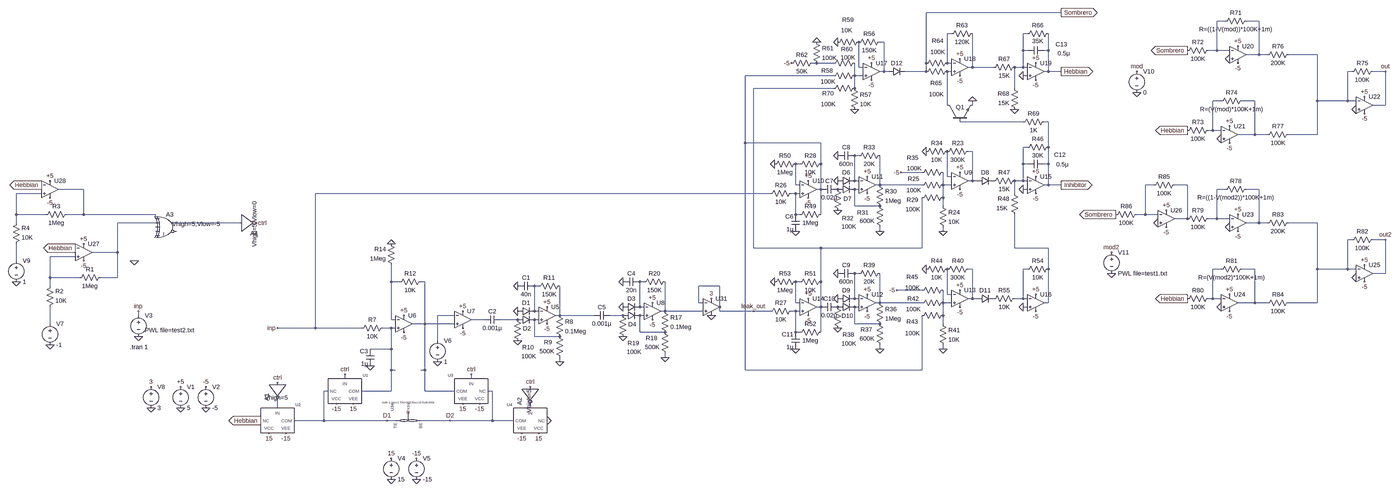
[diagram p0: schematic Draft2.asc, whole sheet]
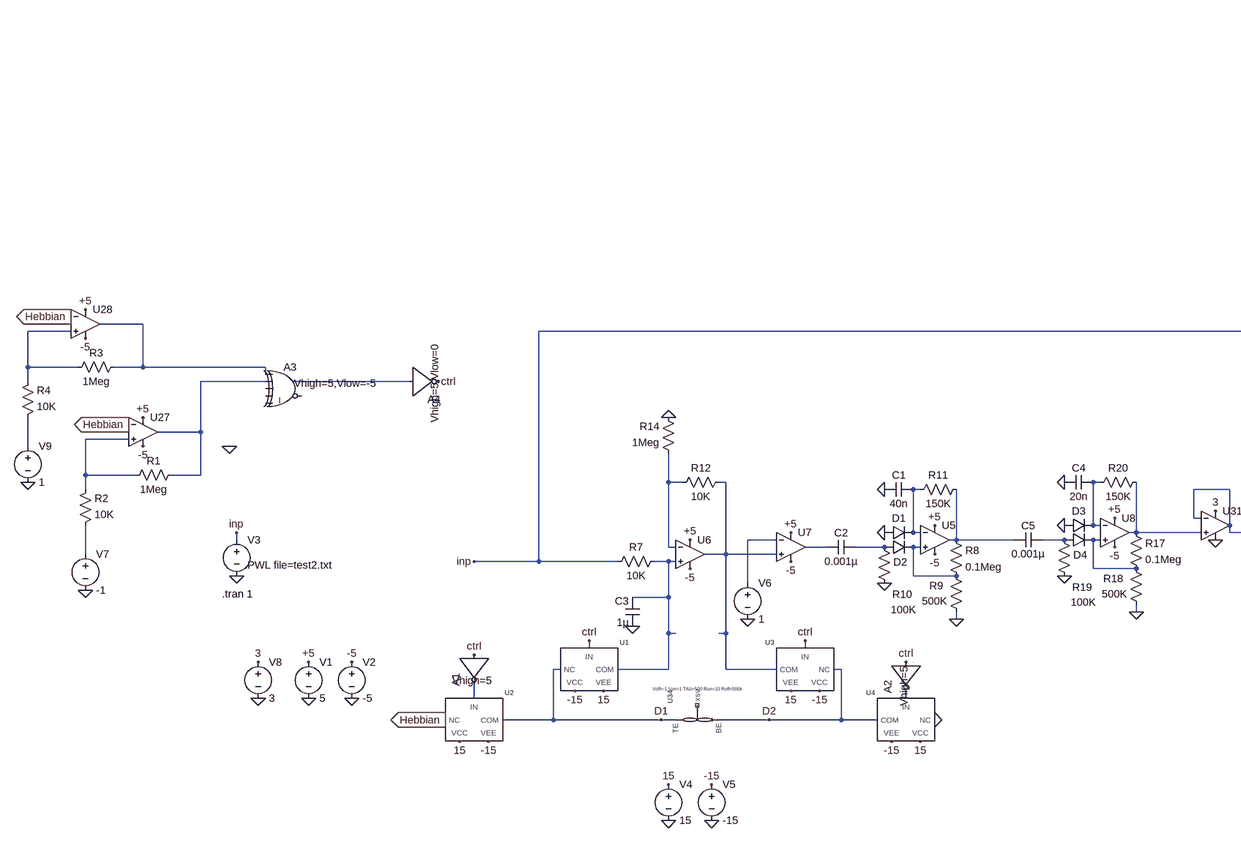
[diagram p1: schematic Draft2.asc, part, row 1 of 1, column 1 of 2]
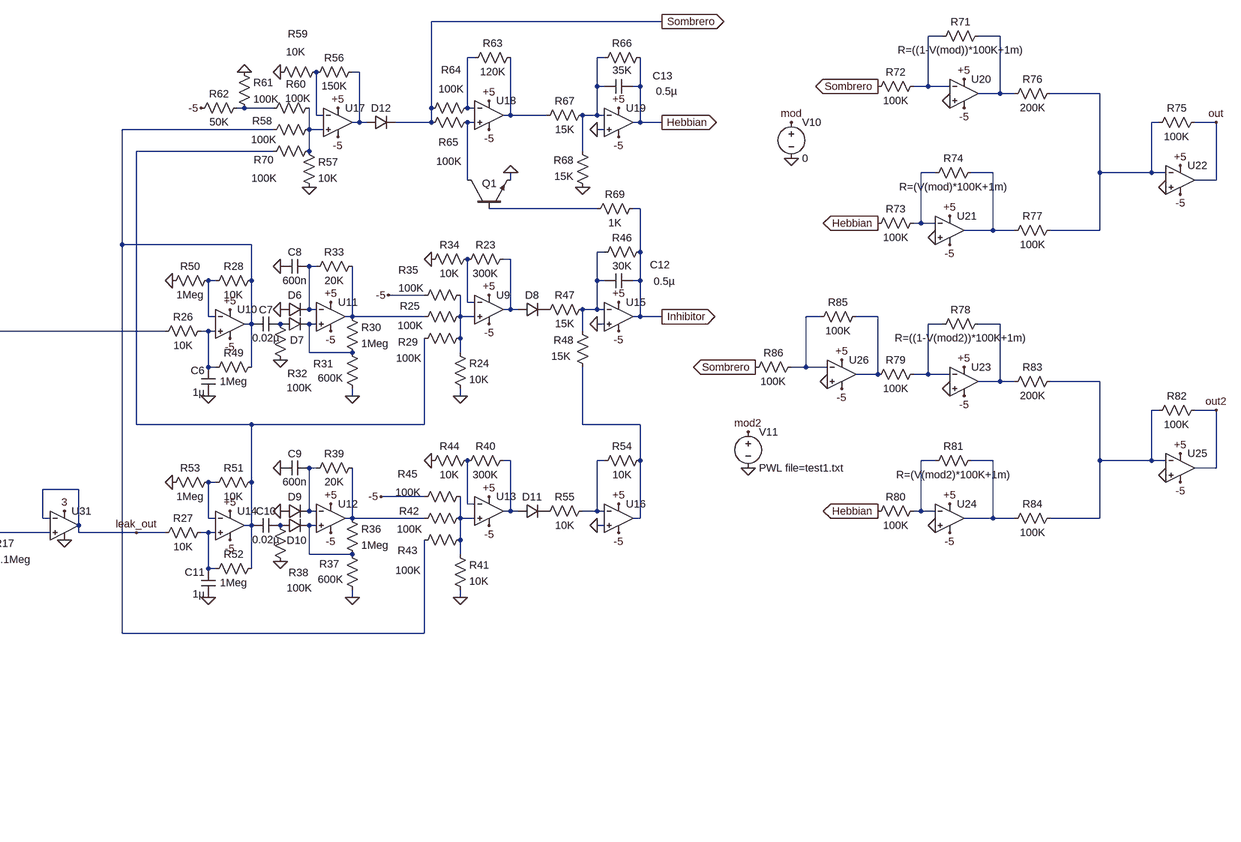
[diagram p2: schematic Draft2.asc, part, row 1 of 1, column 2 of 2]
Draft2.asc, the LTspice schematic file:
Version 4
SHEET 1 6588 1044
WIRE 4112 -1312 3600 -1312
WIRE 4736 -1280 4704 -1280
WIRE 4864 -1280 4816 -1280
WIRE 3696 -1232 3680 -1232
WIRE 3984 -1232 3968 -1232
WIRE 3440 -1200 3424 -1200
WIRE 3968 -1168 3968 -1232
WIRE 3984 -1168 3968 -1168
WIRE 4064 -1168 4064 -1232
WIRE 4064 -1168 4048 -1168
WIRE 4704 -1168 4704 -1280
WIRE 4704 -1168 4672 -1168
WIRE 4752 -1168 4704 -1168
WIRE 4864 -1152 4864 -1280
WIRE 4864 -1152 4816 -1152
WIRE 4896 -1152 4864 -1152
WIRE 5136 -1152 4976 -1152
WIRE 3184 -1120 3168 -1120
WIRE 3248 -1120 3184 -1120
WIRE 3600 -1120 3600 -1312
WIRE 3680 -1120 3680 -1232
WIRE 3696 -1120 3680 -1120
WIRE 3344 -1104 3344 -1200
WIRE 3360 -1104 3344 -1104
WIRE 3776 -1104 3776 -1232
WIRE 3776 -1104 3760 -1104
WIRE 3856 -1104 3776 -1104
WIRE 3968 -1104 3968 -1168
WIRE 3968 -1104 3936 -1104
WIRE 3984 -1104 3968 -1104
WIRE 3440 -1088 3440 -1200
WIRE 3440 -1088 3424 -1088
WIRE 3456 -1088 3440 -1088
WIRE 3600 -1088 3600 -1120
WIRE 3600 -1088 3520 -1088
WIRE 3696 -1088 3680 -1088
WIRE 4064 -1088 4064 -1168
WIRE 4064 -1088 4048 -1088
WIRE 4112 -1088 4064 -1088
WIRE 5280 -1088 5264 -1088
WIRE 5408 -1088 5360 -1088
WIRE 3248 -1072 2912 -1072
WIRE 3328 -1072 3328 -1120
WIRE 3360 -1072 3328 -1072
WIRE 3984 -1072 3968 -1072
WIRE 3248 -1024 2944 -1024
WIRE 3328 -1024 3328 -1072
WIRE 3936 -1024 3936 -1104
WIRE 4720 -976 4688 -976
WIRE 4848 -976 4800 -976
WIRE 5136 -976 5136 -1152
WIRE 5264 -976 5264 -1088
WIRE 5264 -976 5136 -976
WIRE 5296 -976 5264 -976
WIRE 3680 -960 3680 -1088
WIRE 3776 -960 3776 -976
WIRE 5408 -960 5408 -1088
WIRE 5408 -960 5360 -960
WIRE 3968 -896 3728 -896
WIRE 4064 -896 4048 -896
WIRE 4688 -864 4688 -976
WIRE 4688 -864 4672 -864
WIRE 4720 -864 4688 -864
WIRE 4848 -848 4848 -976
WIRE 4848 -848 4784 -848
WIRE 4896 -848 4848 -848
WIRE 5136 -848 5136 -976
WIRE 5136 -848 4976 -848
WIRE 2912 -816 2912 -1072
WIRE 3200 -816 2912 -816
WIRE 3984 -800 3968 -800
WIRE 4064 -800 4064 -896
WIRE 3776 -784 3760 -784
WIRE 3344 -768 3328 -768
WIRE 3120 -736 3104 -736
WIRE 3200 -736 3200 -816
WIRE 3968 -736 3968 -800
WIRE 3984 -736 3968 -736
WIRE 4064 -736 4064 -800
WIRE 4064 -736 4048 -736
WIRE 3584 -704 3504 -704
WIRE 3680 -688 3680 -784
WIRE 3696 -688 3680 -688
WIRE 3328 -672 3328 -768
WIRE 3344 -672 3328 -672
WIRE 3776 -672 3776 -784
WIRE 3776 -672 3760 -672
WIRE 3792 -672 3776 -672
WIRE 3968 -672 3968 -736
WIRE 3968 -672 3936 -672
WIRE 3984 -672 3968 -672
WIRE 3104 -656 3104 -736
WIRE 3120 -656 3104 -656
WIRE 3424 -656 3424 -768
WIRE 3424 -656 3408 -656
WIRE 3584 -656 3424 -656
WIRE 3664 -656 3664 -704
WIRE 3696 -656 3664 -656
WIRE 4064 -656 4064 -736
WIRE 4064 -656 4048 -656
WIRE 4112 -656 4064 -656
WIRE 4464 -656 4432 -656
WIRE 4592 -656 4544 -656
WIRE 400 -640 304 -640
WIRE 3200 -640 3200 -736
WIRE 3200 -640 3184 -640
WIRE 3344 -640 3328 -640
WIRE 3984 -640 3968 -640
WIRE 4736 -640 4704 -640
WIRE 4864 -640 4816 -640
WIRE 240 -624 144 -624
WIRE 3008 -624 1280 -624
WIRE 3104 -624 3088 -624
WIRE 3120 -624 3104 -624
WIRE 3936 -624 3936 -672
WIRE 3664 -608 3664 -656
WIRE 3328 -576 3328 -640
WIRE 3424 -576 3328 -576
WIRE 3664 -576 3664 -608
WIRE 144 -544 144 -624
WIRE 256 -544 144 -544
WIRE 400 -544 400 -640
WIRE 400 -544 336 -544
WIRE 672 -544 400 -544
WIRE 3104 -544 3104 -624
WIRE 3120 -544 3104 -544
WIRE 3200 -544 3200 -640
WIRE 4432 -544 4432 -656
WIRE 4432 -544 4400 -544
WIRE 4480 -544 4432 -544
WIRE 672 -528 672 -544
WIRE 4592 -528 4592 -656
WIRE 4592 -528 4544 -528
WIRE 4704 -528 4704 -640
WIRE 4704 -528 4672 -528
WIRE 4752 -528 4704 -528
WIRE 144 -512 144 -544
WIRE 672 -512 528 -512
WIRE 992 -512 736 -512
WIRE 4864 -512 4864 -640
WIRE 4864 -512 4816 -512
WIRE 4896 -512 4864 -512
WIRE 5136 -512 4976 -512
WIRE 3424 -480 3424 -496
WIRE 3664 -480 3664 -496
WIRE 5280 -448 5264 -448
WIRE 5408 -448 5360 -448
WIRE 2944 -416 2944 -1024
WIRE 3200 -416 2944 -416
WIRE 3584 -416 3584 -608
WIRE 3584 -416 3200 -416
WIRE 3936 -416 3936 -544
WIRE 4064 -416 3936 -416
WIRE 528 -400 528 -512
WIRE 528 -400 432 -400
WIRE 368 -384 272 -384
WIRE 144 -368 144 -432
WIRE 3776 -336 3760 -336
WIRE 3984 -336 3968 -336
WIRE 4064 -336 4064 -416
WIRE 4720 -336 4688 -336
WIRE 4848 -336 4800 -336
WIRE 5136 -336 5136 -512
WIRE 5264 -336 5264 -448
WIRE 5264 -336 5136 -336
WIRE 5296 -336 5264 -336
WIRE 3344 -320 3328 -320
WIRE 5408 -320 5408 -448
WIRE 5408 -320 5360 -320
WIRE 272 -304 272 -384
WIRE 384 -304 272 -304
WIRE 528 -304 528 -400
WIRE 528 -304 464 -304
WIRE 1568 -288 1568 -352
WIRE 1600 -288 1568 -288
WIRE 1696 -288 1680 -288
WIRE 2528 -288 2512 -288
WIRE 3120 -288 3104 -288
WIRE 3200 -288 3200 -416
WIRE 272 -272 272 -304
WIRE 2128 -272 2112 -272
WIRE 2816 -272 2736 -272
WIRE 3584 -256 3488 -256
WIRE 3680 -240 3680 -336
WIRE 3696 -240 3680 -240
WIRE 3328 -224 3328 -320
WIRE 3344 -224 3328 -224
WIRE 3776 -224 3776 -336
WIRE 3776 -224 3760 -224
WIRE 3792 -224 3776 -224
WIRE 3968 -224 3968 -336
WIRE 3968 -224 3936 -224
WIRE 3984 -224 3968 -224
WIRE 4688 -224 4688 -336
WIRE 4688 -224 4672 -224
WIRE 4720 -224 4688 -224
WIRE 2736 -208 2736 -272
WIRE 2752 -208 2736 -208
WIRE 3104 -208 3104 -288
WIRE 3120 -208 3104 -208
WIRE 3424 -208 3424 -320
WIRE 3424 -208 3408 -208
WIRE 3584 -208 3424 -208
WIRE 3664 -208 3664 -256
WIRE 3696 -208 3664 -208
WIRE 4064 -208 4064 -336
WIRE 4064 -208 4048 -208
WIRE 4848 -208 4848 -336
WIRE 4848 -208 4784 -208
WIRE 4896 -208 4848 -208
WIRE 5136 -208 5136 -336
WIRE 5136 -208 4976 -208
WIRE 2512 -192 2512 -288
WIRE 2528 -192 2512 -192
WIRE 2816 -192 2816 -272
WIRE 3200 -192 3200 -288
WIRE 3200 -192 3184 -192
WIRE 3344 -192 3328 -192
WIRE 3984 -192 3968 -192
WIRE 2112 -176 2112 -272
WIRE 2128 -176 2112 -176
WIRE 2608 -176 2608 -288
WIRE 2608 -176 2592 -176
WIRE 2752 -176 2608 -176
WIRE 2816 -176 2816 -192
WIRE 2944 -176 2816 -176
WIRE 3008 -176 2944 -176
WIRE 3104 -176 3088 -176
WIRE 3120 -176 3104 -176
WIRE 608 -160 608 -176
WIRE 1808 -160 1744 -160
WIRE 2208 -160 2208 -272
WIRE 2208 -160 2192 -160
WIRE 2336 -160 2208 -160
WIRE 2448 -160 2400 -160
WIRE 2528 -160 2512 -160
WIRE 3664 -160 3664 -208
WIRE 1568 -144 1568 -288
WIRE 1584 -144 1568 -144
WIRE 1920 -144 1872 -144
WIRE 2048 -144 1984 -144
WIRE 2128 -144 2112 -144
WIRE 272 -128 272 -192
WIRE 1696 -128 1696 -288
WIRE 1696 -128 1648 -128
WIRE 1808 -128 1696 -128
WIRE 3328 -128 3328 -192
WIRE 3424 -128 3328 -128
WIRE 3664 -128 3664 -160
WIRE 1280 -112 1280 -624
WIRE 1280 -112 1136 -112
WIRE 1456 -112 1280 -112
WIRE 1568 -112 1536 -112
WIRE 1584 -112 1568 -112
WIRE 2512 -96 2512 -160
WIRE 2608 -96 2512 -96
WIRE 3104 -96 3104 -176
WIRE 3120 -96 3104 -96
WIRE 3200 -96 3200 -192
WIRE 2112 -80 2112 -144
WIRE 2208 -80 2112 -80
WIRE 1744 -64 1744 -160
WIRE 1568 -32 1568 -112
WIRE 1568 -32 1488 -32
WIRE 3424 -32 3424 -48
WIRE 3664 -32 3664 -48
WIRE 2608 0 2608 -16
WIRE 2208 16 2208 0
WIRE 1568 48 1568 -32
WIRE 1584 48 1568 48
WIRE 1696 48 1696 -128
WIRE 1696 48 1680 48
WIRE 2912 48 2912 -816
WIRE 3584 48 3584 -160
WIRE 3584 48 2912 48
WIRE 1392 80 1392 64
WIRE 1872 80 1872 64
WIRE 1328 128 1312 128
WIRE 1568 128 1568 48
WIRE 1568 128 1456 128
WIRE 1696 128 1696 48
WIRE 1808 128 1696 128
WIRE 1952 128 1936 128
WIRE 1136 192 1136 160
WIRE 2096 192 2096 176
WIRE 1312 240 1312 128
WIRE 1312 240 1200 240
WIRE 1552 240 1312 240
WIRE 1584 240 1552 240
WIRE 1792 240 1680 240
WIRE 1952 240 1952 128
WIRE 1952 240 1792 240
WIRE 2032 240 1952 240
FLAG 768 112 +5
FLAG 864 112 -5
FLAG 768 192 0
FLAG 864 192 0
FLAG 608 -80 0
FLAG 608 -176 inp
FLAG 2160 -192 +5
FLAG 2160 -128 -5
FLAG 2048 -176 0
FLAG 2048 -272 0
FLAG 2048 -64 0
FLAG 2208 16 0
FLAG 1616 -160 +5
FLAG 1616 -96 -5
FLAG 1488 32 0
FLAG 1568 -432 0
FLAG 1840 -176 +5
FLAG 1840 -112 -5
FLAG 2560 -208 +5
FLAG 2560 -144 -5
FLAG 2448 -192 0
FLAG 2448 -288 0
FLAG 2448 -80 0
FLAG 2608 0 0
FLAG 3728 -704 +5
FLAG 3728 -640 -5
FLAG 3152 -672 +5
FLAG 3152 -608 -5
FLAG 3376 -688 +5
FLAG 3376 -624 -5
FLAG 3264 -672 0
FLAG 3264 -768 0
FLAG 3264 -560 0
FLAG 3600 -784 0
FLAG 3504 -704 -5
FLAG 3376 -240 +5
FLAG 3376 -176 -5
FLAG 3264 -224 0
FLAG 3264 -320 0
FLAG 3264 -112 0
FLAG 3424 -32 0
FLAG 3424 -480 0
FLAG 3728 -256 +5
FLAG 3728 -192 -5
FLAG 3600 -336 0
FLAG 3488 -256 -5
FLAG 3104 -480 0
FLAG 3024 -736 0
FLAG 3152 -224 +5
FLAG 3152 -160 -5
FLAG 3104 -32 0
FLAG 3024 -288 0
FLAG 4016 -688 +5
FLAG 4016 -624 -5
FLAG 4016 -240 +5
FLAG 4016 -176 -5
FLAG 3968 -192 0
FLAG 3968 -640 0
FLAG 3664 -480 0
FLAG 3664 -32 0
FLAG 4112 -656 Inhibitor
IOPIN 4112 -656 Out
FLAG 3392 -1120 +5
FLAG 3392 -1056 -5
FLAG 3264 -1200 0
FLAG 3184 -1200 0
FLAG 3728 -1136 +5
FLAG 3728 -1072 -5
FLAG 3088 -1120 -5
FLAG 4016 -1120 +5
FLAG 4016 -1056 -5
FLAG 3968 -1072 0
FLAG 3936 -944 0
FLAG 3776 -976 0
FLAG 4112 -1088 Hebbian
IOPIN 4112 -1088 Out
FLAG 4112 -1312 Sombrero
IOPIN 4112 -1312 Out
FLAG 3328 -944 0
FLAG 4752 -880 +5
FLAG 4752 -816 -5
FLAG 4784 -1184 +5
FLAG 4784 -1120 -5
FLAG 4752 -1136 0
FLAG 4720 -832 0
FLAG 5328 -992 +5
FLAG 5328 -928 -5
FLAG 5296 -944 0
FLAG 4592 -1168 Sombrero
IOPIN 4592 -1168 Out
FLAG 4592 -864 Hebbian
IOPIN 4592 -864 Out
FLAG 4400 -1008 0
FLAG 4400 -1088 mod
FLAG 5408 -1088 out
FLAG 4752 -240 +5
FLAG 4752 -176 -5
FLAG 4784 -544 +5
FLAG 4784 -480 -5
FLAG 4752 -496 0
FLAG 4720 -192 0
FLAG 5328 -352 +5
FLAG 5328 -288 -5
FLAG 5296 -304 0
FLAG 4320 -544 Sombrero
IOPIN 4320 -544 Out
FLAG 4592 -224 Hebbian
IOPIN 4592 -224 Out
FLAG 4304 -320 0
FLAG 4304 -400 mod2
FLAG 5408 -448 out2
FLAG 4512 -560 +5
FLAG 4512 -496 -5
FLAG 4480 -512 0
FLAG 1136 -112 inp
FLAG 1744 16 0
FLAG 2944 -176 leak_out
FLAG 2784 -160 0
FLAG 1360 176 -15
FLAG 1424 176 15
FLAG 1552 240 D1
FLAG 1104 288 15
FLAG 1168 288 -15
FLAG 2064 288 -15
FLAG 2128 288 15
FLAG 1840 176 15
FLAG 1904 176 -15
FLAG 1568 464 0
FLAG 1664 464 0
FLAG 1568 384 15
FLAG 1664 384 -15
FLAG 1792 240 D2
FLAG 1392 64 ctrl
FLAG 1872 64 ctrl
FLAG 2096 112 ctrl
FLAG 1136 96 ctrl
FLAG 400 -432 +5
FLAG 400 -368 -5
FLAG 272 -48 0
FLAG 368 -416 Hebbian
IOPIN 368 -416 Out
FLAG 272 -672 +5
FLAG 272 -608 -5
FLAG 144 -288 0
FLAG 240 -656 Hebbian
IOPIN 240 -656 Out
FLAG 1056 -512 ctrl
FLAG 656 112 3
FLAG 656 192 0
FLAG 2784 -224 3
FLAG 2160 240 0
FLAG 592 -368 0
FLAG 1072 240 Hebbian
IOPIN 1072 240 Out
SYMBOL voltage 768 96 R0
WINDOW 123 0 0 Left 2
WINDOW 39 0 0 Left 2
SYMATTR InstName V1
SYMATTR Value 5
SYMBOL voltage 864 96 R0
WINDOW 123 0 0 Left 2
WINDOW 39 0 0 Left 2
SYMATTR InstName V2
SYMATTR Value -5
SYMBOL voltage 608 -176 R0
WINDOW 123 0 0 Left 2
WINDOW 39 24 44 Left 2
WINDOW 3 24 72 Left 2
SYMATTR Value PWL file=test2.txt
SYMATTR InstName V3
SYMBOL res 1552 -128 R90
WINDOW 0 0 56 VBottom 2
WINDOW 3 32 56 VTop 2
SYMATTR InstName R7
SYMATTR Value 10K
SYMBOL Opamps\\UniversalOpamp2 2160 -160 R0
SYMATTR InstName U5
SYMBOL diode 2048 -160 R270
WINDOW 0 32 32 VTop 2
WINDOW 3 0 32 Invisible 2
SYMATTR InstName D1
SYMBOL diode 2048 -128 R270
WINDOW 0 -33 36 VTop 2
WINDOW 3 0 32 Invisible 2
SYMATTR InstName D2
SYMBOL res 2192 -176 R0
SYMATTR InstName R8
SYMATTR Value 0.1Meg
SYMBOL res 2224 16 R180
WINDOW 0 45 74 Left 2
WINDOW 3 36 40 Left 2
SYMATTR InstName R9
SYMATTR Value 500K
SYMBOL res 2032 -160 R0
WINDOW 0 34 121 Left 2
WINDOW 3 30 155 Left 2
SYMATTR InstName R10
SYMATTR Value 100K
SYMBOL res 2224 -288 R90
WINDOW 0 0 56 VBottom 2
WINDOW 3 32 56 VTop 2
SYMATTR InstName R11
SYMATTR Value 150K
SYMBOL cap 2112 -288 R90
WINDOW 0 0 32 VBottom 2
WINDOW 3 32 32 VTop 2
SYMATTR InstName C1
SYMATTR Value 40n
SYMBOL cap 1984 -160 R90
WINDOW 0 0 32 VBottom 2
WINDOW 3 32 32 VTop 2
SYMATTR InstName C2
SYMATTR Value 0.001µ
SYMBOL Opamps\\UniversalOpamp2 1616 -128 R0
SYMATTR InstName U6
SYMBOL cap 1504 32 R180
WINDOW 0 24 56 Left 2
WINDOW 3 24 8 Left 2
SYMATTR InstName C3
SYMATTR Value 1µ
SYMATTR SpiceLine V=4 Irms=5.18 Rser=0.0171188 Lser=0 mfg="KEMET" pn="C0603C105K7PAC" type="X5R"
SYMBOL res 1696 -304 R90
WINDOW 0 0 56 VBottom 2
WINDOW 3 32 56 VTop 2
SYMATTR InstName R12
SYMATTR Value 10K
SYMBOL res 1584 -336 R180
WINDOW 0 36 76 Left 2
WINDOW 3 36 40 Left 2
SYMATTR InstName R14
SYMATTR Value 1Meg
SYMBOL Opamps\\UniversalOpamp2 1840 -144 R0
SYMATTR InstName U7
SYMBOL Opamps\\UniversalOpamp2 2560 -176 R0
SYMATTR InstName U8
SYMBOL diode 2448 -176 R270
WINDOW 0 32 32 VTop 2
WINDOW 3 0 32 Invisible 2
SYMATTR InstName D3
SYMBOL diode 2448 -144 R270
WINDOW 0 -33 36 VTop 2
WINDOW 3 0 32 Invisible 2
SYMATTR InstName D4
SYMBOL res 2592 -192 R0
SYMATTR InstName R17
SYMATTR Value 0.1Meg
SYMBOL res 2624 0 R180
WINDOW 0 45 74 Left 2
WINDOW 3 36 40 Left 2
SYMATTR InstName R18
SYMATTR Value 500K
SYMBOL res 2432 -176 R0
WINDOW 0 34 121 Left 2
WINDOW 3 30 155 Left 2
SYMATTR InstName R19
SYMATTR Value 100K
SYMBOL res 2624 -304 R90
WINDOW 0 0 56 VBottom 2
WINDOW 3 32 56 VTop 2
SYMATTR InstName R20
SYMATTR Value 150K
SYMBOL cap 2512 -304 R90
WINDOW 0 0 32 VBottom 2
WINDOW 3 32 32 VTop 2
SYMATTR InstName C4
SYMATTR Value 20n
SYMBOL cap 2400 -176 R90
WINDOW 0 0 32 VBottom 2
WINDOW 3 32 32 VTop 2
SYMATTR InstName C5
SYMATTR Value 0.001µ
SYMBOL Opamps\\UniversalOpamp2 3728 -672 R0
SYMATTR InstName U9
SYMBOL res 3776 -800 R90
WINDOW 0 0 56 VBottom 2
WINDOW 3 32 56 VTop 2
SYMATTR InstName R23
SYMATTR Value 300K
SYMBOL res 3648 -592 R0
SYMATTR InstName R24
SYMATTR Value 10K
SYMBOL res 3680 -672 R90
WINDOW 0 8 128 VBottom 2
WINDOW 3 20 127 VTop 2
SYMATTR InstName R25
SYMATTR Value 100K
SYMBOL Opamps\\UniversalOpamp2 3152 -640 R0
SYMATTR InstName U10
SYMBOL cap 3120 -480 R180
WINDOW 0 24 56 Left 2
WINDOW 3 24 8 Left 2
SYMATTR InstName C6
SYMATTR Value 1µ
SYMBOL res 3104 -640 R90
WINDOW 0 0 56 VBottom 2
WINDOW 3 32 56 VTop 2
SYMATTR InstName R26
SYMATTR Value 10K
SYMBOL res 3104 -192 R90
WINDOW 0 0 56 VBottom 2
WINDOW 3 32 56 VTop 2
SYMATTR InstName R27
SYMATTR Value 10K
SYMBOL res 3216 -752 R90
WINDOW 0 0 56 VBottom 2
WINDOW 3 32 56 VTop 2
SYMATTR InstName R28
SYMATTR Value 10K
SYMBOL res 3680 -624 R90
WINDOW 0 40 132 VBottom 2
WINDOW 3 45 130 VTop 2
SYMATTR InstName R29
SYMATTR Value 100K
SYMBOL Opamps\\UniversalOpamp2 3376 -656 R0
SYMATTR InstName U11
SYMBOL diode 3264 -656 R270
WINDOW 0 32 32 VTop 2
WINDOW 3 0 32 Invisible 2
SYMATTR InstName D6
SYMBOL diode 3264 -624 R270
WINDOW 0 -36 37 VTop 2
WINDOW 3 0 32 Invisible 2
SYMATTR InstName D7
SYMBOL res 3408 -672 R0
SYMATTR InstName R30
SYMATTR Value 1Meg
SYMBOL res 3440 -480 R180
WINDOW 0 58 71 Left 2
WINDOW 3 36 40 Left 2
SYMATTR InstName R31
SYMATTR Value 600K
SYMBOL res 3248 -656 R0
WINDOW 0 32 126 Left 2
WINDOW 3 30 158 Left 2
SYMATTR InstName R32
SYMATTR Value 100K
SYMBOL cap 3264 -656 R90
WINDOW 0 0 32 VBottom 2
WINDOW 3 32 32 VTop 2
SYMATTR InstName C7
SYMATTR Value 0.02µ
SYMBOL res 3440 -784 R90
WINDOW 0 0 56 VBottom 2
WINDOW 3 32 56 VTop 2
SYMATTR InstName R33
SYMATTR Value 20K
SYMBOL cap 3328 -784 R90
WINDOW 0 0 32 VBottom 2
WINDOW 3 32 32 VTop 2
SYMATTR InstName C8
SYMATTR Value 600n
SYMBOL res 3584 -768 R270
WINDOW 0 32 56 VTop 2
WINDOW 3 0 56 VBottom 2
SYMATTR InstName R34
SYMATTR Value 10K
SYMBOL diode 3792 -656 R270
WINDOW 0 32 32 VTop 2
WINDOW 3 0 32 Invisible 2
SYMATTR InstName D8
SYMBOL res 3680 -720 R90
WINDOW 0 -24 131 VBottom 2
WINDOW 3 -15 125 VTop 2
SYMATTR InstName R35
SYMATTR Value 100K
SYMBOL Opamps\\UniversalOpamp2 3376 -208 R0
SYMATTR InstName U12
SYMBOL diode 3264 -208 R270
WINDOW 0 32 32 VTop 2
WINDOW 3 0 32 Invisible 2
SYMATTR InstName D9
SYMBOL diode 3264 -176 R270
WINDOW 0 -33 36 VTop 2
WINDOW 3 0 32 Invisible 2
SYMATTR InstName D10
SYMBOL res 3408 -224 R0
SYMATTR InstName R36
SYMATTR Value 1Meg
SYMBOL res 3440 -32 R180
WINDOW 0 45 74 Left 2
WINDOW 3 36 40 Left 2
SYMATTR InstName R37
SYMATTR Value 600K
SYMBOL res 3248 -208 R0
WINDOW 0 34 121 Left 2
WINDOW 3 30 155 Left 2
SYMATTR InstName R38
SYMATTR Value 100K
SYMBOL res 3440 -336 R90
WINDOW 0 0 56 VBottom 2
WINDOW 3 32 56 VTop 2
SYMATTR InstName R39
SYMATTR Value 20K
SYMBOL cap 3328 -336 R90
WINDOW 0 0 32 VBottom 2
WINDOW 3 32 32 VTop 2
SYMATTR InstName C9
SYMATTR Value 600n
SYMBOL cap 3264 -208 R90
WINDOW 0 0 32 VBottom 2
WINDOW 3 32 32 VTop 2
SYMATTR InstName C10
SYMATTR Value 0.02µ
SYMBOL Opamps\\UniversalOpamp2 3728 -224 R0
SYMATTR InstName U13
SYMBOL res 3776 -352 R90
WINDOW 0 0 56 VBottom 2
WINDOW 3 32 56 VTop 2
SYMATTR InstName R40
SYMATTR Value 300K
SYMBOL res 3648 -144 R0
SYMATTR InstName R41
SYMATTR Value 10K
SYMBOL res 3680 -224 R90
WINDOW 0 16 130 VBottom 2
WINDOW 3 25 129 VTop 2
SYMATTR InstName R42
SYMATTR Value 100K
SYMBOL res 3680 -176 R90
WINDOW 0 55 133 VBottom 2
WINDOW 3 68 132 VTop 2
SYMATTR InstName R43
SYMATTR Value 100K
SYMBOL res 3584 -320 R270
WINDOW 0 32 56 VTop 2
WINDOW 3 0 56 VBottom 2
SYMATTR InstName R44
SYMATTR Value 10K
SYMBOL diode 3792 -208 R270
WINDOW 0 32 32 VTop 2
WINDOW 3 0 32 Invisible 2
SYMATTR InstName D11
SYMBOL res 3680 -272 R90
WINDOW 0 -19 133 VBottom 2
WINDOW 3 -9 132 VTop 2
SYMATTR InstName R45
SYMATTR Value 100K
SYMBOL res 4080 -816 R90
WINDOW 0 0 56 VBottom 2
WINDOW 3 32 56 VTop 2
SYMATTR InstName R46
SYMATTR Value 30K
SYMBOL res 3952 -688 R90
WINDOW 0 0 56 VBottom 2
WINDOW 3 32 56 VTop 2
SYMATTR InstName R47
SYMATTR Value 15K
SYMBOL res 3952 -528 R180
WINDOW 0 36 76 Left 2
WINDOW 3 43 40 Left 2
SYMATTR InstName R48
SYMATTR Value 15K
SYMBOL res 3216 -560 R90
WINDOW 0 0 56 VBottom 2
WINDOW 3 32 56 VTop 2
SYMATTR InstName R49
SYMATTR Value 1Meg
SYMBOL res 3120 -752 R90
WINDOW 0 0 56 VBottom 2
WINDOW 3 32 56 VTop 2
SYMATTR InstName R50
SYMATTR Value 1Meg
SYMBOL Opamps\\UniversalOpamp2 3152 -192 R0
SYMATTR InstName U14
SYMBOL cap 3120 -32 R180
WINDOW 0 24 56 Left 2
WINDOW 3 24 8 Left 2
SYMATTR InstName C11
SYMATTR Value 1µ
SYMBOL res 3216 -304 R90
WINDOW 0 0 56 VBottom 2
WINDOW 3 32 56 VTop 2
SYMATTR InstName R51
SYMATTR Value 10K
SYMBOL res 3216 -112 R90
WINDOW 0 0 56 VBottom 2
WINDOW 3 32 56 VTop 2
SYMATTR InstName R52
SYMATTR Value 1Meg
SYMBOL res 3120 -304 R90
WINDOW 0 0 56 VBottom 2
WINDOW 3 32 56 VTop 2
SYMATTR InstName R53
SYMATTR Value 1Meg
SYMBOL Opamps\\UniversalOpamp2 4016 -656 R0
SYMATTR InstName U15
SYMBOL res 4080 -352 R90
WINDOW 0 0 56 VBottom 2
WINDOW 3 32 56 VTop 2
SYMATTR InstName R54
SYMATTR Value 10K
SYMBOL Opamps\\UniversalOpamp2 4016 -208 R0
SYMATTR InstName U16
SYMBOL res 3952 -240 R90
WINDOW 0 0 56 VBottom 2
WINDOW 3 32 56 VTop 2
SYMATTR InstName R55
SYMATTR Value 10K
SYMBOL cap 4048 -752 R90
WINDOW 0 -4 -60 VBottom 2
WINDOW 3 2 -70 VTop 2
SYMATTR InstName C12
SYMATTR Value 0.5µ
SYMBOL Opamps\\UniversalOpamp2 3392 -1088 R0
SYMATTR InstName U17
SYMBOL res 3440 -1216 R90
WINDOW 0 0 56 VBottom 2
WINDOW 3 32 56 VTop 2
SYMATTR InstName R56
SYMATTR Value 150K
SYMBOL res 3312 -1040 R0
SYMATTR InstName R57
SYMATTR Value 10K
SYMBOL res 3344 -1088 R90
WINDOW 0 12 120 VBottom 2
WINDOW 3 23 117 VTop 2
SYMATTR InstName R58
SYMATTR Value 100K
SYMBOL res 3248 -1184 R270
WINDOW 0 85 55 VTop 2
WINDOW 3 76 50 VBottom 2
SYMATTR InstName R59
SYMATTR Value 10K
SYMBOL res 3344 -1136 R90
WINDOW 0 -21 45 VBottom 2
WINDOW 3 -21 41 VTop 2
SYMATTR InstName R60
SYMATTR Value 100K
SYMBOL res 3168 -1216 R0
SYMATTR InstName R61
SYMATTR Value 100K
SYMBOL res 3184 -1136 R90
WINDOW 0 0 56 VBottom 2
WINDOW 3 32 56 VTop 2
SYMATTR InstName R62
SYMATTR Value 50K
SYMBOL diode 3456 -1072 R270
WINDOW 0 32 32 VTop 2
WINDOW 3 0 32 Invisible 2
SYMATTR InstName D12
SYMBOL res 3792 -1248 R90
WINDOW 0 0 56 VBottom 2
WINDOW 3 32 56 VTop 2
SYMATTR InstName R63
SYMATTR Value 120K
SYMBOL Opamps\\UniversalOpamp2 3728 -1104 R0
SYMATTR InstName U18
SYMBOL res 3696 -1136 R90
WINDOW 0 -53 52 VBottom 2
WINDOW 3 -42 52 VTop 2
SYMATTR InstName R64
SYMATTR Value 100K
SYMBOL res 3696 -1104 R90
WINDOW 0 76 58 VBottom 2
WINDOW 3 87 57 VTop 2
SYMATTR InstName R65
SYMATTR Value 100K
SYMBOL npn 3680 -896 R270
WINDOW 0 56 32 VRight 2
WINDOW 3 56 68 Invisible 2
SYMATTR InstName Q1
SYMBOL res 4080 -1248 R90
WINDOW 0 0 56 VBottom 2
WINDOW 3 60 56 VBottom 2
SYMATTR InstName R66
SYMATTR Value 35K
SYMBOL res 3952 -1120 R90
WINDOW 0 0 56 VBottom 2
WINDOW 3 32 56 VTop 2
SYMATTR InstName R67
SYMATTR Value 15K
SYMBOL res 3952 -928 R180
WINDOW 0 36 76 Left 2
WINDOW 3 36 40 Left 2
SYMATTR InstName R68
SYMATTR Value 15K
SYMBOL Opamps\\UniversalOpamp2 4016 -1088 R0
SYMATTR InstName U19
SYMBOL cap 4048 -1184 R90
WINDOW 0 8 -66 VBottom 2
WINDOW 3 11 -75 VTop 2
SYMATTR InstName C13
SYMATTR Value 0.5µ
SYMBOL res 3952 -880 R270
WINDOW 0 32 56 VTop 2
WINDOW 3 0 56 VBottom 2
SYMATTR InstName R69
SYMATTR Value 1K
SYMBOL res 3344 -1040 R90
WINDOW 0 51 117 VBottom 2
WINDOW 3 61 116 VTop 2
SYMATTR InstName R70
SYMATTR Value 100K
SYMBOL Opamps\\UniversalOpamp2 4784 -1152 R0
SYMATTR InstName U20
SYMBOL Opamps\\UniversalOpamp2 4752 -848 R0
SYMATTR InstName U21
SYMBOL res 4832 -1296 R90
WINDOW 0 0 56 VBottom 2
WINDOW 3 32 56 VTop 2
SYMATTR InstName R71
SYMATTR Value R=((1-V(mod))*100K+1m)
SYMBOL res 4688 -1184 R90
WINDOW 0 0 56 VBottom 2
WINDOW 3 32 56 VTop 2
SYMATTR InstName R72
SYMATTR Value 100K
SYMBOL res 4688 -880 R90
WINDOW 0 0 56 VBottom 2
WINDOW 3 32 56 VTop 2
SYMATTR InstName R73
SYMATTR Value 100K
SYMBOL res 4816 -992 R90
WINDOW 0 0 56 VBottom 2
WINDOW 3 32 56 VTop 2
SYMATTR InstName R74
SYMATTR Value R=(V(mod)*100K+1m)
SYMBOL Opamps\\UniversalOpamp2 5328 -960 R0
SYMATTR InstName U22
SYMBOL res 5376 -1104 R90
WINDOW 0 0 56 VBottom 2
WINDOW 3 32 56 VTop 2
SYMATTR InstName R75
SYMATTR Value 100K
SYMBOL res 4992 -1168 R90
WINDOW 0 0 56 VBottom 2
WINDOW 3 32 56 VTop 2
SYMATTR InstName R76
SYMATTR Value 200K
SYMBOL res 4992 -864 R90
WINDOW 0 0 56 VBottom 2
WINDOW 3 32 56 VTop 2
SYMATTR InstName R77
SYMATTR Value 100K
SYMBOL voltage 4400 -1104 R0
WINDOW 123 0 0 Left 2
WINDOW 39 0 0 Left 2
SYMATTR InstName V10
SYMATTR Value 0
SYMBOL Opamps\\UniversalOpamp2 4784 -512 R0
SYMATTR InstName U23
SYMBOL Opamps\\UniversalOpamp2 4752 -208 R0
SYMATTR InstName U24
SYMBOL res 4832 -656 R90
WINDOW 0 0 56 VBottom 2
WINDOW 3 32 56 VTop 2
SYMATTR InstName R78
SYMATTR Value R=((1-V(mod2))*100K+1m)
SYMBOL res 4688 -544 R90
WINDOW 0 0 56 VBottom 2
WINDOW 3 32 56 VTop 2
SYMATTR InstName R79
SYMATTR Value 100K
SYMBOL res 4688 -240 R90
WINDOW 0 0 56 VBottom 2
WINDOW 3 32 56 VTop 2
SYMATTR InstName R80
SYMATTR Value 100K
SYMBOL res 4816 -352 R90
WINDOW 0 0 56 VBottom 2
WINDOW 3 32 56 VTop 2
SYMATTR InstName R81
SYMATTR Value R=(V(mod2)*100K+1m)
SYMBOL Opamps\\UniversalOpamp2 5328 -320 R0
SYMATTR InstName U25
SYMBOL res 5376 -464 R90
WINDOW 0 0 56 VBottom 2
WINDOW 3 32 56 VTop 2
SYMATTR InstName R82
SYMATTR Value 100K
SYMBOL res 4992 -528 R90
WINDOW 0 0 56 VBottom 2
WINDOW 3 32 56 VTop 2
SYMATTR InstName R83
SYMATTR Value 200K
SYMBOL res 4992 -224 R90
WINDOW 0 0 56 VBottom 2
WINDOW 3 32 56 VTop 2
SYMATTR InstName R84
SYMATTR Value 100K
SYMBOL voltage 4304 -416 R0
WINDOW 123 0 0 Left 2
WINDOW 39 0 0 Left 2
SYMATTR InstName V11
SYMATTR Value PWL file=test1.txt
SYMBOL Opamps\\UniversalOpamp2 4512 -528 R0
SYMATTR InstName U26
SYMBOL res 4560 -672 R90
WINDOW 0 0 56 VBottom 2
WINDOW 3 32 56 VTop 2
SYMATTR InstName R85
SYMATTR Value 100K
SYMBOL res 4416 -560 R90
WINDOW 0 0 56 VBottom 2
WINDOW 3 32 56 VTop 2
SYMATTR InstName R86
SYMATTR Value 100K
SYMBOL voltage 1744 -80 R0
WINDOW 123 0 0 Left 2
WINDOW 39 0 0 Left 2
SYMATTR InstName V6
SYMATTR Value 1
SYMBOL Opamps\\UniversalOpamp2 2784 -192 R0
SYMATTR InstName U31
SYMBOL memristor_with_state 1632 240 R270
WINDOW 3 68 0 VCenter 0
SYMATTR Value Voff=-1 Von=1 TAU=500 Ron=10 Roff=500k
SYMATTR InstName U34
SYMBOL voltage 1568 368 R0
WINDOW 123 0 0 Left 2
WINDOW 39 0 0 Left 2
SYMATTR InstName V4
SYMATTR Value 15
SYMBOL voltage 1664 368 R0
WINDOW 123 0 0 Left 2
WINDOW 39 0 0 Left 2
SYMATTR InstName V5
SYMATTR Value -15
SYMBOL MemristiveBrain\\TS12A4517 1392 128 R0
SYMATTR InstName U1
SYMBOL MemristiveBrain\\TS12A4517 1136 240 R0
SYMATTR InstName U2
SYMBOL MemristiveBrain\\TS12A4517 1872 128 M0
SYMATTR InstName U3
SYMBOL MemristiveBrain\\TS12A4517 2096 240 M0
SYMATTR InstName U4
SYMBOL Digital\\inv 1072 96 M90
WINDOW 3 41 60 VTop 2
SYMATTR Value Vhigh=5
SYMATTR InstName A1
SYMBOL Digital\\inv 2032 112 M90
WINDOW 3 8 60 Left 2
SYMATTR Value Vhigh=5
SYMATTR InstName A2
SYMBOL Opamps\\UniversalOpamp2 400 -400 R0
SYMATTR InstName U27
SYMBOL res 480 -320 R90
WINDOW 0 0 56 VBottom 2
WINDOW 3 32 56 VTop 2
SYMATTR InstName R1
SYMATTR Value 1Meg
SYMBOL res 256 -176 M180
WINDOW 0 36 76 Left 2
WINDOW 3 36 40 Left 2
SYMATTR InstName R2
SYMATTR Value 10K
SYMBOL voltage 272 -144 R0
WINDOW 123 0 0 Left 2
WINDOW 39 0 0 Left 2
SYMATTR InstName V7
SYMATTR Value -1
SYMBOL Opamps\\UniversalOpamp2 272 -640 R0
SYMATTR InstName U28
SYMBOL res 352 -560 R90
WINDOW 0 0 56 VBottom 2
WINDOW 3 32 56 VTop 2
SYMATTR InstName R3
SYMATTR Value 1Meg
SYMBOL res 128 -416 M180
WINDOW 0 36 76 Left 2
WINDOW 3 36 40 Left 2
SYMATTR InstName R4
SYMATTR Value 10K
SYMBOL voltage 144 -384 R0
WINDOW 123 0 0 Left 2
WINDOW 39 0 0 Left 2
SYMATTR InstName V9
SYMATTR Value 1
SYMBOL Digital\\xor 720 -560 R0
WINDOW 3 16 52 Left 2
SYMATTR Value Vhigh=5,Vlow=-5
SYMATTR InstName A3
SYMBOL Digital\\inv 992 -448 M180
WINDOW 3 41 60 VTop 2
SYMATTR Value Vhigh=5,Vlow=0
SYMATTR InstName A4
SYMBOL voltage 656 96 R0
WINDOW 123 0 0 Left 2
WINDOW 39 0 0 Left 2
SYMATTR InstName V8
SYMATTR Value 3
TEXT 576 -40 Left 2 !.tran 1

The netlist it stands for:
* Draft2.asc
V1 +5 0 5
V2 -5 0 -5
V3 inp 0 PWL file=test2.txt
R7 N062 inp 10K
XU5 N060 N047 +5 -5 N055 level.2 Avol=1Meg GBW=10Meg Slew=10Meg ilimit=25m rail=0 Vos=0 phimargin=45 en=0 enk=0 in=0 ink=0 Rin=500Meg  ; pins IN+ IN- V+ V- OUT
D1 0 N047 D
D2 N059 N060 D
R8 N055 N060 0.1Meg
R9 0 N060 500K
R10 N059 0 100K
R11 N055 N047 150K
C1 N047 0 40n
C2 N059 N058 0.001µ
XU6 N062 N043 +5 -5 N044 level.2 Avol=1Meg GBW=10Meg Slew=10Meg ilimit=25m rail=0 Vos=0 phimargin=45 en=0 enk=0 in=0 ink=0 Rin=500Meg  ; pins IN+ IN- V+ V- OUT
C3 0 N062 1µ V=4 Irms=5.18 Rser=0.0171188 Lser=0 mfg="KEMET" pn="C0603C105K7PAC" type="X5R"
R12 N044 N043 10K
R14 N043 0 1Meg
XU7 N044 N054 +5 -5 N058 level.2 Avol=1Meg GBW=10Meg Slew=10Meg ilimit=25m rail=0 Vos=0 phimargin=45 en=0 enk=0 in=0 ink=0 Rin=500Meg  ; pins IN+ IN- V+ V- OUT
XU8 N057 N045 +5 -5 N052 level.2 Avol=1Meg GBW=10Meg Slew=10Meg ilimit=25m rail=0 Vos=0 phimargin=45 en=0 enk=0 in=0 ink=0 Rin=500Meg  ; pins IN+ IN- V+ V- OUT
D3 0 N045 D
D4 N056 N057 D
R17 N052 N057 0.1Meg
R18 0 N057 500K
R19 N056 0 100K
R20 N052 N045 150K
C4 N045 0 20n
C5 N056 N055 0.001µ
XU9 N023 N021 +5 -5 N018 level.2 Avol=1Meg GBW=10Meg Slew=10Meg ilimit=25m rail=0 Vos=0 phimargin=45 en=0 enk=0 in=0 ink=0 Rin=500Meg  ; pins IN+ IN- V+ V- OUT
R23 N018 N021 300K
R24 N023 0 10K
R25 N023 N022 100K
XU10 N031 N020 +5 -5 N011 level.2 Avol=1Meg GBW=10Meg Slew=10Meg ilimit=25m rail=0 Vos=0 phimargin=45 en=0 enk=0 in=0 ink=0 Rin=500Meg  ; pins IN+ IN- V+ V- OUT
C6 0 N031 1µ
R26 N031 inp 10K
R27 N053 leak_out 10K
R28 N011 N020 10K
R29 N023 N013 100K
XU11 N027 N019 +5 -5 N022 level.2 Avol=1Meg GBW=10Meg Slew=10Meg ilimit=25m rail=0 Vos=0 phimargin=45 en=0 enk=0 in=0 ink=0 Rin=500Meg  ; pins IN+ IN- V+ V- OUT
D6 0 N019 D
D7 P001 N027 D
R30 N022 N027 1Meg
R31 0 N027 600K
R32 P001 0 100K
C7 P001 N011 0.02µ
R33 N022 N019 20K
C8 N019 0 600n
R34 0 N021 10K
D8 N018 P002 D
R35 N023 -5 100K
XU12 N051 N042 +5 -5 N049 level.2 Avol=1Meg GBW=10Meg Slew=10Meg ilimit=25m rail=0 Vos=0 phimargin=45 en=0 enk=0 in=0 ink=0 Rin=500Meg  ; pins IN+ IN- V+ V- OUT
D9 0 N042 D
D10 P003 N051 D
R36 N049 N051 1Meg
R37 0 N051 600K
R38 P003 0 100K
R39 N049 N042 20K
C9 N042 0 600n
C10 P003 N013 0.02µ
XU13 N050 N048 +5 -5 N038 level.2 Avol=1Meg GBW=10Meg Slew=10Meg ilimit=25m rail=0 Vos=0 phimargin=45 en=0 enk=0 in=0 ink=0 Rin=500Meg  ; pins IN+ IN- V+ V- OUT
R40 N038 N048 300K
R41 N050 0 10K
R42 N050 N049 100K
R43 N050 N011 100K
R44 0 N048 10K
D11 N038 P004 D
R45 N050 -5 100K
R46 Inhibitor N017 30K
R47 N017 P002 15K
R48 N035 N017 15K
R49 N011 N031 1Meg
R50 N020 0 1Meg
XU14 N053 N046 +5 -5 N013 level.2 Avol=1Meg GBW=10Meg Slew=10Meg ilimit=25m rail=0 Vos=0 phimargin=45 en=0 enk=0 in=0 ink=0 Rin=500Meg  ; pins IN+ IN- V+ V- OUT
C11 0 N053 1µ
R51 N013 N046 10K
R52 N013 N053 1Meg
R53 N046 0 1Meg
XU15 0 N017 +5 -5 Inhibitor level.2 Avol=1Meg GBW=10Meg Slew=10Meg ilimit=25m rail=0 Vos=0 phimargin=45 en=0 enk=0 in=0 ink=0 Rin=500Meg  ; pins IN+ IN- V+ V- OUT
R54 N035 N039 10K
XU16 0 N039 +5 -5 N035 level.2 Avol=1Meg GBW=10Meg Slew=10Meg ilimit=25m rail=0 Vos=0 phimargin=45 en=0 enk=0 in=0 ink=0 Rin=500Meg  ; pins IN+ IN- V+ V- OUT
R55 N039 P004 10K
C12 Inhibitor N017 0.5µ
XU17 N012 N008 +5 -5 N005 level.2 Avol=1Meg GBW=10Meg Slew=10Meg ilimit=25m rail=0 Vos=0 phimargin=45 en=0 enk=0 in=0 ink=0 Rin=500Meg  ; pins IN+ IN- V+ V- OUT
R56 N005 N008 150K
R57 N012 0 10K
R58 N012 N011 100K
R59 0 N008 10K
R60 N012 N007 100K
R61 0 N007 100K
R62 N007 -5 50K
D12 N005 Sombrero D
R63 N009 N003 120K
XU18 N010 N003 +5 -5 N009 level.2 Avol=1Meg GBW=10Meg Slew=10Meg ilimit=25m rail=0 Vos=0 phimargin=45 en=0 enk=0 in=0 ink=0 Rin=500Meg  ; pins IN+ IN- V+ V- OUT
R64 N003 Sombrero 100K
R65 N010 Sombrero 100K
Q1 N010 N016 0 0 NPN
R66 Hebbian N004 35K
R67 N004 N009 15K
R68 0 N004 15K
XU19 0 N004 +5 -5 Hebbian level.2 Avol=1Meg GBW=10Meg Slew=10Meg ilimit=25m rail=0 Vos=0 phimargin=45 en=0 enk=0 in=0 ink=0 Rin=500Meg  ; pins IN+ IN- V+ V- OUT
C13 Hebbian N004 0.5µ
R69 N016 Inhibitor 1K
R70 N012 N013 100K
XU20 0 N001 +5 -5 N002 level.2 Avol=1Meg GBW=10Meg Slew=10Meg ilimit=25m rail=0 Vos=0 phimargin=45 en=0 enk=0 in=0 ink=0 Rin=500Meg  ; pins IN+ IN- V+ V- OUT
XU21 0 N014 +5 -5 N015 level.2 Avol=1Meg GBW=10Meg Slew=10Meg ilimit=25m rail=0 Vos=0 phimargin=45 en=0 enk=0 in=0 ink=0 Rin=500Meg  ; pins IN+ IN- V+ V- OUT
R71 N002 N001 R=((1-V(mod))*100K+1m)
R72 N001 Sombrero 100K
R73 N014 Hebbian 100K
R74 N015 N014 R=(V(mod)*100K+1m)
XU22 0 N006 +5 -5 out level.2 Avol=1Meg GBW=10Meg Slew=10Meg ilimit=25m rail=0 Vos=0 phimargin=45 en=0 enk=0 in=0 ink=0 Rin=500Meg  ; pins IN+ IN- V+ V- OUT
R75 out N006 100K
R76 N006 N002 200K
R77 N006 N015 100K
V10 mod 0 0
XU23 0 N028 +5 -5 N029 level.2 Avol=1Meg GBW=10Meg Slew=10Meg ilimit=25m rail=0 Vos=0 phimargin=45 en=0 enk=0 in=0 ink=0 Rin=500Meg  ; pins IN+ IN- V+ V- OUT
XU24 0 N040 +5 -5 N041 level.2 Avol=1Meg GBW=10Meg Slew=10Meg ilimit=25m rail=0 Vos=0 phimargin=45 en=0 enk=0 in=0 ink=0 Rin=500Meg  ; pins IN+ IN- V+ V- OUT
R78 N029 N028 R=((1-V(mod2))*100K+1m)
R79 N028 N025 100K
R80 N040 Hebbian 100K
R81 N041 N040 R=(V(mod2)*100K+1m)
XU25 0 N034 +5 -5 out2 level.2 Avol=1Meg GBW=10Meg Slew=10Meg ilimit=25m rail=0 Vos=0 phimargin=45 en=0 enk=0 in=0 ink=0 Rin=500Meg  ; pins IN+ IN- V+ V- OUT
R82 out2 N034 100K
R83 N034 N029 200K
R84 N034 N041 100K
V11 mod2 0 PWL file=test1.txt
XU26 0 N024 +5 -5 N025 level.2 Avol=1Meg GBW=10Meg Slew=10Meg ilimit=25m rail=0 Vos=0 phimargin=45 en=0 enk=0 in=0 ink=0 Rin=500Meg  ; pins IN+ IN- V+ V- OUT
R85 N025 N024 100K
R86 N024 Sombrero 100K
V6 N054 0 1
XU31 N052 leak_out 3 0 leak_out level.2 Avol=1Meg GBW=10Meg Slew=10Meg ilimit=25m rail=0 Vos=0 phimargin=45 en=0 enk=0 in=0 ink=0 Rin=500Meg  ; pins IN+ IN- V+ V- OUT
XU34 D1 D2 NC_01 MEM_JOGLEKAR Voff=-1 Von=1 TAU=500 Ron=10 Roff=500k  ; pins TE BE xsv
V4 15 0 15
V5 -15 0 -15
XU1 ctrl D1 N062 -15 15 TS12A4517  ; pins IN NC COM VCC VEE
XU2 N063 Hebbian D1 15 -15 TS12A4517  ; pins IN NC COM VCC VEE
XU3 ctrl D2 N044 -15 15 TS12A4517  ; pins IN NC COM VCC VEE
XU4 N064 0 D2 15 -15 TS12A4517  ; pins IN NC COM VCC VEE
A1 ctrl 0 0 0 0 N063 0 0 BUF Vhigh=5
A2 ctrl 0 0 0 0 N064 0 0 BUF Vhigh=5
XU27 N036 Hebbian +5 -5 N032 level.2 Avol=1Meg GBW=10Meg Slew=10Meg ilimit=25m rail=0 Vos=0 phimargin=45 en=0 enk=0 in=0 ink=0 Rin=500Meg  ; pins IN+ IN- V+ V- OUT
R1 N032 N036 1Meg
R2 N061 N036 10K
V7 N061 0 -1
XU28 N030 Hebbian +5 -5 N026 level.2 Avol=1Meg GBW=10Meg Slew=10Meg ilimit=25m rail=0 Vos=0 phimargin=45 en=0 enk=0 in=0 ink=0 Rin=500Meg  ; pins IN+ IN- V+ V- OUT
R3 N026 N030 1Meg
R4 N037 N030 10K
V9 N037 0 1
A3 N026 N032 0 0 0 0 N033 0 XOR Vhigh=5,Vlow=-5
A4 N033 0 0 0 0 ctrl 0 0 BUF Vhigh=5,Vlow=0
V8 3 0 3
.model D D
.lib standard.dio
.model NPN NPN
.model PNP PNP
.lib standard.bjt
.tran 1
.lib UniversalOpamps2.sub
.lib memristor_with_state.sub
.backanno
.end